# EAGLE design SmartLEDShield_ESP32_V0 (EAGLE 8.6.3)
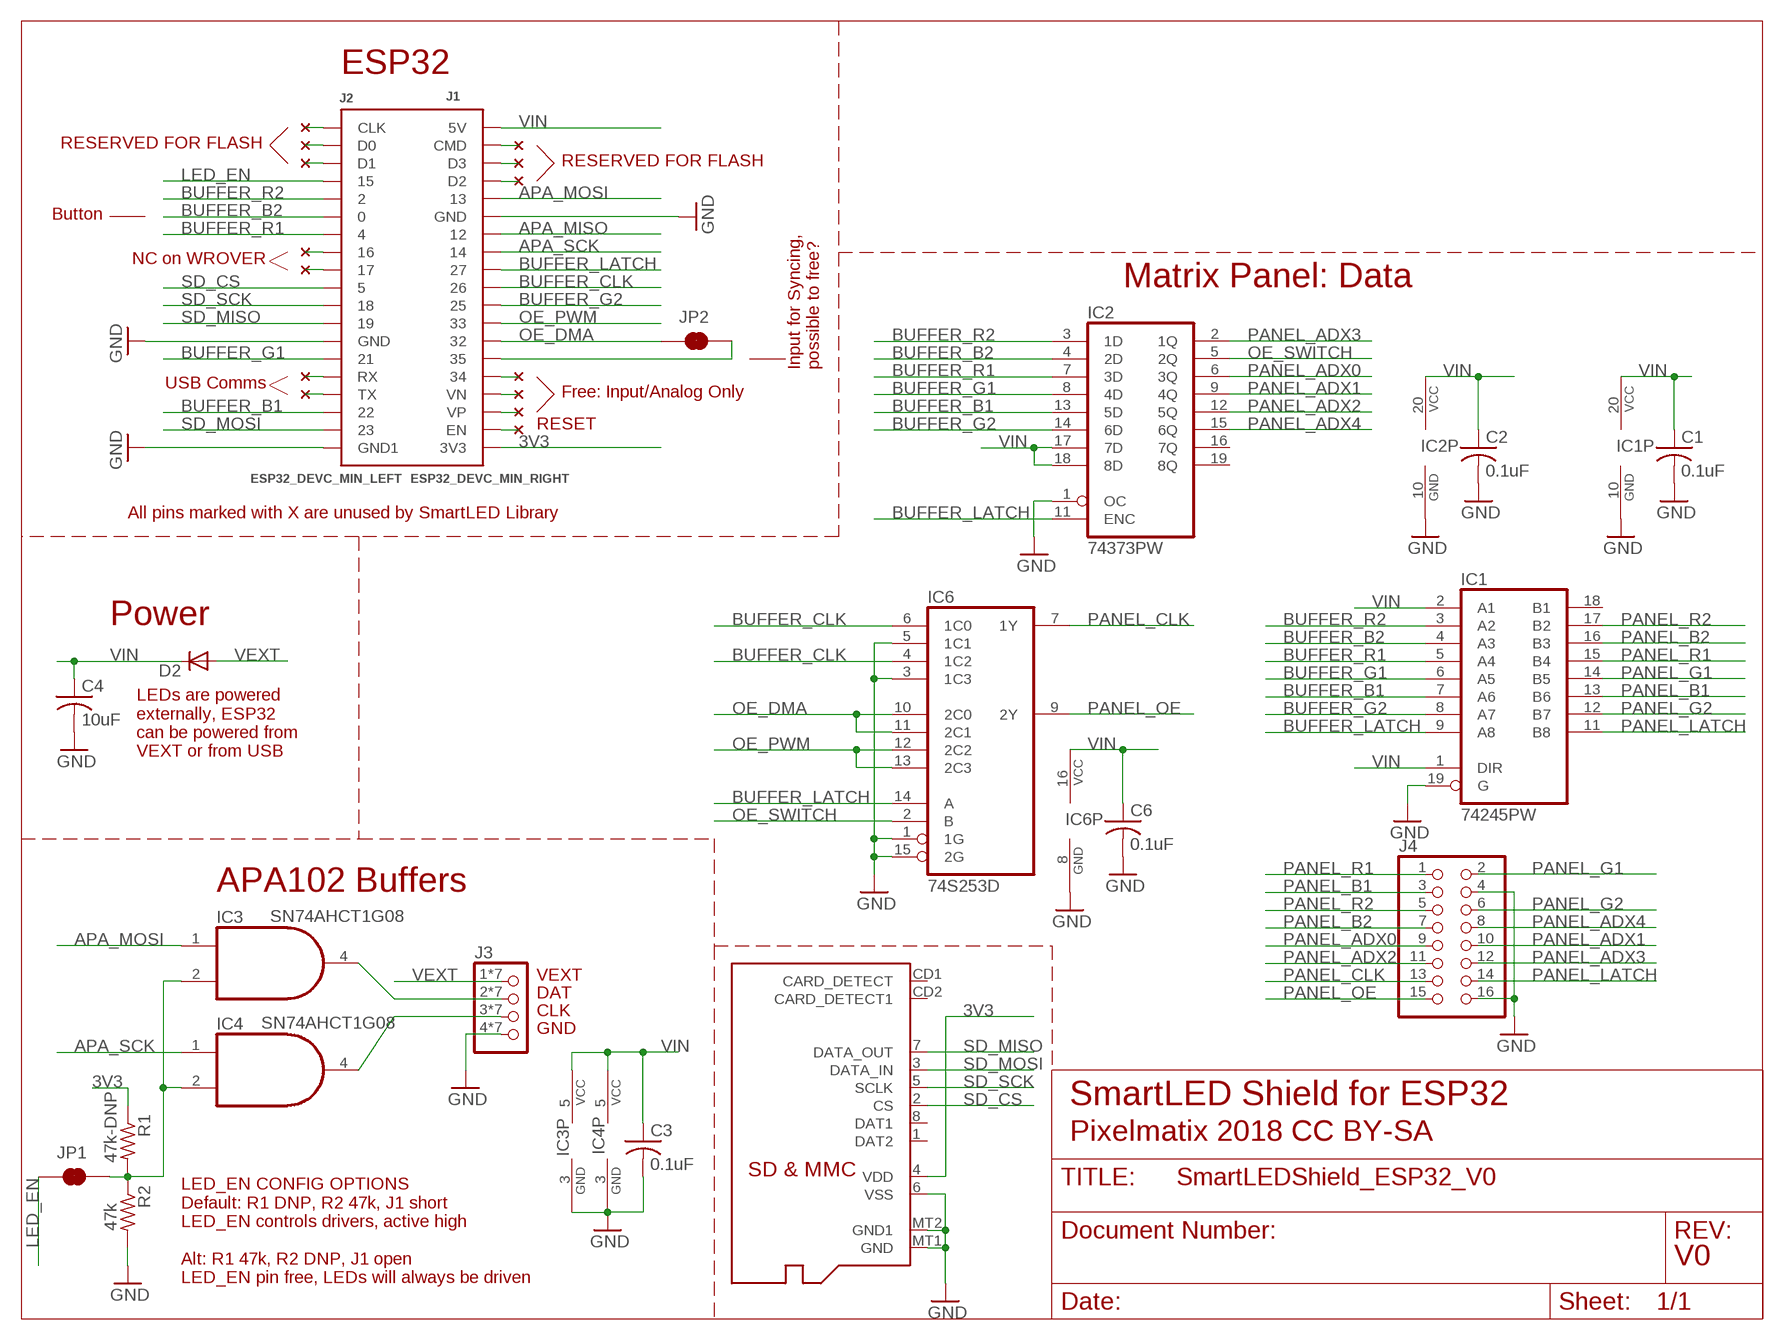
[diagram p0: schematic, sheet 1]

## Parts
C1  0.1uF  C-USC0603  [C0603]
C2  0.1uF  C-USC0603  [C0603]
C3  0.1uF  C-USC0603  [C0603]
C4  10uF  C-USC0805  [C0805]
C6  0.1uF  C-USC0603  [C0603]
D2  MBR1020VL  [SOD123-FL]
IC1  74245PW  [TSSOP-20]
IC2  74373PW  [TSSOP-20]
IC3  74AHC1G08DBV  [SOT23-5]
IC4  74AHC1G08DBV  [SOT23-5]
IC6  74S253D  [SO16]
J1  ESP32_DEVC_MIN_RIGHT  [ESP32_DEVC_DUAL_HEADER_BOT_MOUNT_RIGHT]
J2  ESP32_DEVC_MIN_LEFT  [ESP32_DEVC_DUAL_HEADER_BOT_MOUNT_LEFT]
J3  PINHD-1X04_WIREPADS_NARROW  [1X04SMDWIRES_NARROW]
J4  PINHD-2X08_SMARTMATRIX_SSMTHT  [SMARTMATRIX_SSMTHT]
J6  MICROSD  [MICROSD]
JP1  JUMPER-SMT_2_NC_TRACE_NO-SILK  [SMT-JUMPER_2_NC_TRACE_NO-SILK]
JP2  JUMPER-SMT_2_NC_TRACE_NO-SILK  [SMT-JUMPER_2_NC_TRACE_NO-SILK]
R1  47k-DNP  R-US_R0603  [R0603]
R2  47k  R-US_R0603  [R0603]
U$1  NC  (no package)
U$2  NC  (no package)
U$3  NC  (no package)
U$4  NC  (no package)
U$6  NC  (no package)
U$7  NC  (no package)
U$8  NC  (no package)
U$9  NC  (no package)
U$10  NC  (no package)
U$11  NC  (no package)
U$13  NC  (no package)
U$15  NC  (no package)
U$16  NC  (no package)
U$17  NC  (no package)

## Nets
3V3 [power]: J1.3V3A(3V3) J1.3V3B(3V3) J6.4(VDD) R1.1
APA_MISO: J1.12A J1.12B
APA_MOSI: IC3.1(I0) J1.13A_A J1.13B_B
APA_SCK: IC4.1(I0) J1.14A_A J1.14B_B
BUFFER_B1: IC1.7(A6) IC2.13(5D) J2.22A J2.22B
BUFFER_B2: IC1.4(A3) IC2.4(2D) J2.0A J2.0B
BUFFER_CLK: IC6.4(1C2) IC6.6(1C0) J1.26A J1.26B
BUFFER_G1: IC1.6(A5) IC2.8(4D) J2.21A J2.21B
BUFFER_G2: IC1.8(A7) IC2.14(6D) J1.25A J1.25B
BUFFER_LATCH: IC1.9(A8) IC2.11(ENC) IC6.14(A) J1.27A J1.27B
BUFFER_R1: IC1.5(A4) IC2.7(3D) J2.4A J2.4B
BUFFER_R2: IC1.3(A2) IC2.3(1D) J2.2A J2.2B
CLK1: IC4.4(O) J3.3 J3.3-1 J3.3-2 J3.3-3 J3.3-4 J3.3-5 J3.3-6
DAT1: IC3.4(O) J3.2 J3.2-1 J3.2-2 J3.2-3 J3.2-4 J3.2-5 J3.2-6
GND: C1.2 C2.2 C3.2 C4.2 C6.2 IC1.10(GND) IC1.19(G) IC2.1(OC) IC2.10(GND) IC3.3(GND) IC4.3(GND) IC6.1(1G) IC6.3(1C3) IC6.5(1C1) IC6.8(GND) IC6.15(2G) J1.GNDA(GND) J1.GNDB(GND) J2.GND1A(GND1) J2.GND1B(GND1) J2.GNDA(GND) J2.GNDB(GND) J3.4 J3.4-1 J3.4-2 J3.4-3 J3.4-4 J3.4-5 J3.4-6 J4.4 J4.16 J6.6(VSS) J6.MT1(GND) J6.MT2(GND1) R2.2
LED_EN: J2.15A_A J2.15B_B JP1.1
N$1: J1.35A J1.35B JP2.2
N$2: J1.CMD_A(CMD) J1.CMD_B(CMD) U$1.P$1
N$3: J1.D3_A(D3) J1.D3_B(D3) U$2.P$1
N$4: IC3.2(I1) IC4.2(I1) JP1.2 R1.2 R2.1
N$5: J1.D2A(D2) J1.D2B(D2) U$3.P$1
N$6: J2.CLKA(CLK) J2.CLKB(CLK) U$4.P$1
N$7: J2.D0A(D0) J2.D0B(D0) U$6.P$1
N$8: J2.D1A(D1) J2.D1B(D1) U$7.P$1
N$9: J1.VNA(VN) J1.VNB(VN) U$8.P$1
N$10: J1.VPA(VP) J1.VPB(VP) U$9.P$1
N$11: J1.34A J1.34B U$10.P$1
N$13: J1.ENA(EN) J1.ENB(EN) U$11.P$1
N$14: J2.TXA(TX) J2.TXB(TX) U$13.P$1
N$15: J2.RXA(RX) J2.RXB(RX) U$15.P$1
N$16: J2.17A_A J2.17B_B U$16.P$1
N$17: J2.16_B J2.16A_A U$17.P$1
OE_DMA: IC6.10(2C0) IC6.11(2C1) J1.32A J1.32B JP2.1
OE_PWM: IC6.12(2C2) IC6.13(2C3) J1.33A J1.33B
OE_SWITCH: IC2.5(2Q) IC6.2(B)
PANEL_ADX0: IC2.6(3Q) J4.9
PANEL_ADX1: IC2.9(4Q) J4.10
PANEL_ADX2: IC2.12(5Q) J4.11
PANEL_ADX3: IC2.2(1Q) J4.12
PANEL_ADX4: IC2.15(6Q) J4.8
PANEL_B1: IC1.13(B6) J4.3
PANEL_B2: IC1.16(B3) J4.7
PANEL_CLK: IC6.7(1Y) J4.13
PANEL_G1: IC1.14(B5) J4.2
PANEL_G2: IC1.12(B7) J4.6
PANEL_LATCH: IC1.11(B8) J4.14
PANEL_OE: IC6.9(2Y) J4.15
PANEL_R1: IC1.15(B4) J4.1
PANEL_R2: IC1.17(B2) J4.5
SD_CS: J2.5A J2.5B J6.2(CS)
SD_MISO: J2.19A_A J2.19B_B J6.7(DATA_OUT)
SD_MOSI: J2.23A J2.23B J6.3(DATA_IN)
SD_SCK: J2.18A_A J2.18B_B J6.5(SCLK)
VEXT: D2.A J3.1 J3.1-1 J3.1-2 J3.1-3 J3.1-4 J3.1-5 J3.1-6
VIN: C1.1 C2.1 C3.1 C4.1 C6.1 D2.C IC1.1(DIR) IC1.2(A1) IC1.20(VCC) IC2.17(7D) IC2.18(8D) IC2.20(VCC) IC3.5(VCC) IC4.5(VCC) IC6.16(VCC) J1.5V_A(5V) J1.5V_B(5V)
Unconnected: IC1.18(B1) IC2.16(7Q) IC2.19(8Q) J6.1(DAT2) J6.8(DAT1) J6.CD1(CARD_DETECT) J6.CD2(CARD_DETECT1)

## Notes on the sheet
- ESP32
- RESERVED FOR FLASH
- RESERVED FOR FLASH
- Button
- NC on WROVER
- Matrix Panel: Data
- Input for Syncing,
  possible to free?
- USB Comms
- Free: Input/Analog Only
- RESET
- All pins marked with X are unused by SmartLED Library
- Power
- LEDs are powered
  externally, ESP32
  can be powered from
  VEXT or from USB
- APA102 Buffers
- SN74AHCT1G08
- VEXT
- DAT
- CLK
- SN74AHCT1G08
- GND
- SmartLED Shield for ESP32
- Pixelmatix 2018 CC BY-SA
- V0
- LED_EN CONFIG OPTIONS
  Default: R1 DNP, R2 47k, J1 short
  LED_EN controls drivers, active high
  
  Alt: R1 47k, R2 DNP, J1 open
  LED_EN pin free, LEDs will always be driven

## Library data of the parts
C1-C4 C6 = scanlime:C-US: CAPACITOR, American symbol; PARTNO: CAP CER 0.1UF 10V 10% X7R 0805
D2 = eclibrary:MBR1020VL
IC1 = eclibrary:74*245: Octal BUS TRANSCEIVER, 3-state
IC2 = eclibrary:74*373: Octal D type transparent LATCH, edge triggered
IC3 IC4 = 74xx-little-us:74*1G08: 2-input AND gate
IC6 = 74xx-us:74*253: Dual 4-to 1 line data SELECTOR/MULTIPLEXER, 3-state
J1 = eclibrary:ESP32_DEVC_MIN_RIGHT
J2 = eclibrary:ESP32_DEVC_MIN_LEFT
J3 = eclibrary:PINHD-1X04: PIN HEADER
J4 = eclibrary:PINHD-2X08: PIN HEADER
J6 = adafruit:MICROSD: Micro-SD / Transflash card holder with SPI pinout For the 3M # 2908-05WB-MG and/or 4UCON #19656 push-push type; PARTNO: 101-00660-68-6
JP1 JP2 = SparkFun-Jumpers:JUMPER-SMT_2_NC_TRACE: Normally closed trace jumper This jumper has a trace between two pads so it's normally closed (NC). Use a razor knife to open the connection. For best results follow the IPC guidelines for cutting traces: Cutout at least 0.063 mm (0.005 in). Remove all loose material to clean up the cut area. Seal the cut with an approved epoxy. Reapply solder to reclose the connection.
R1 R2 = rcl:R-US_: RESISTOR, American symbol
U$1-U$4 U$6-U$11 U$13 U$15-U$17 = eclibrary:NC

## Net classes
0 default: width 0.254 mm
1 power: width 0.406 mm

## Board
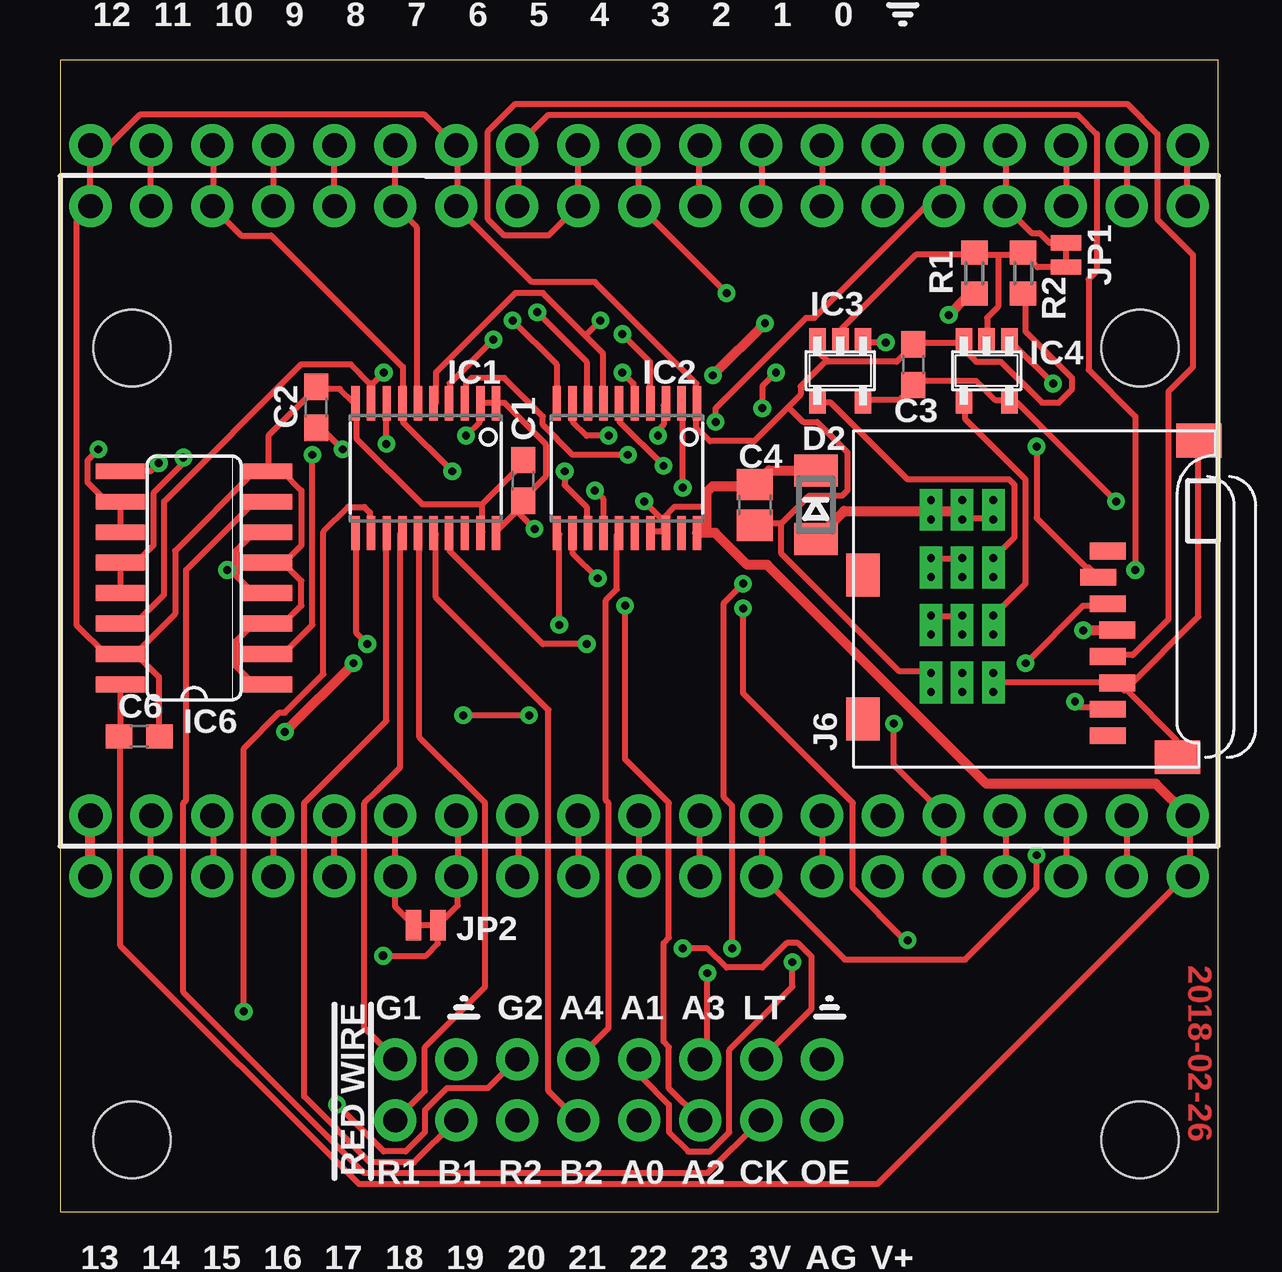
[diagram p1: board, top side]
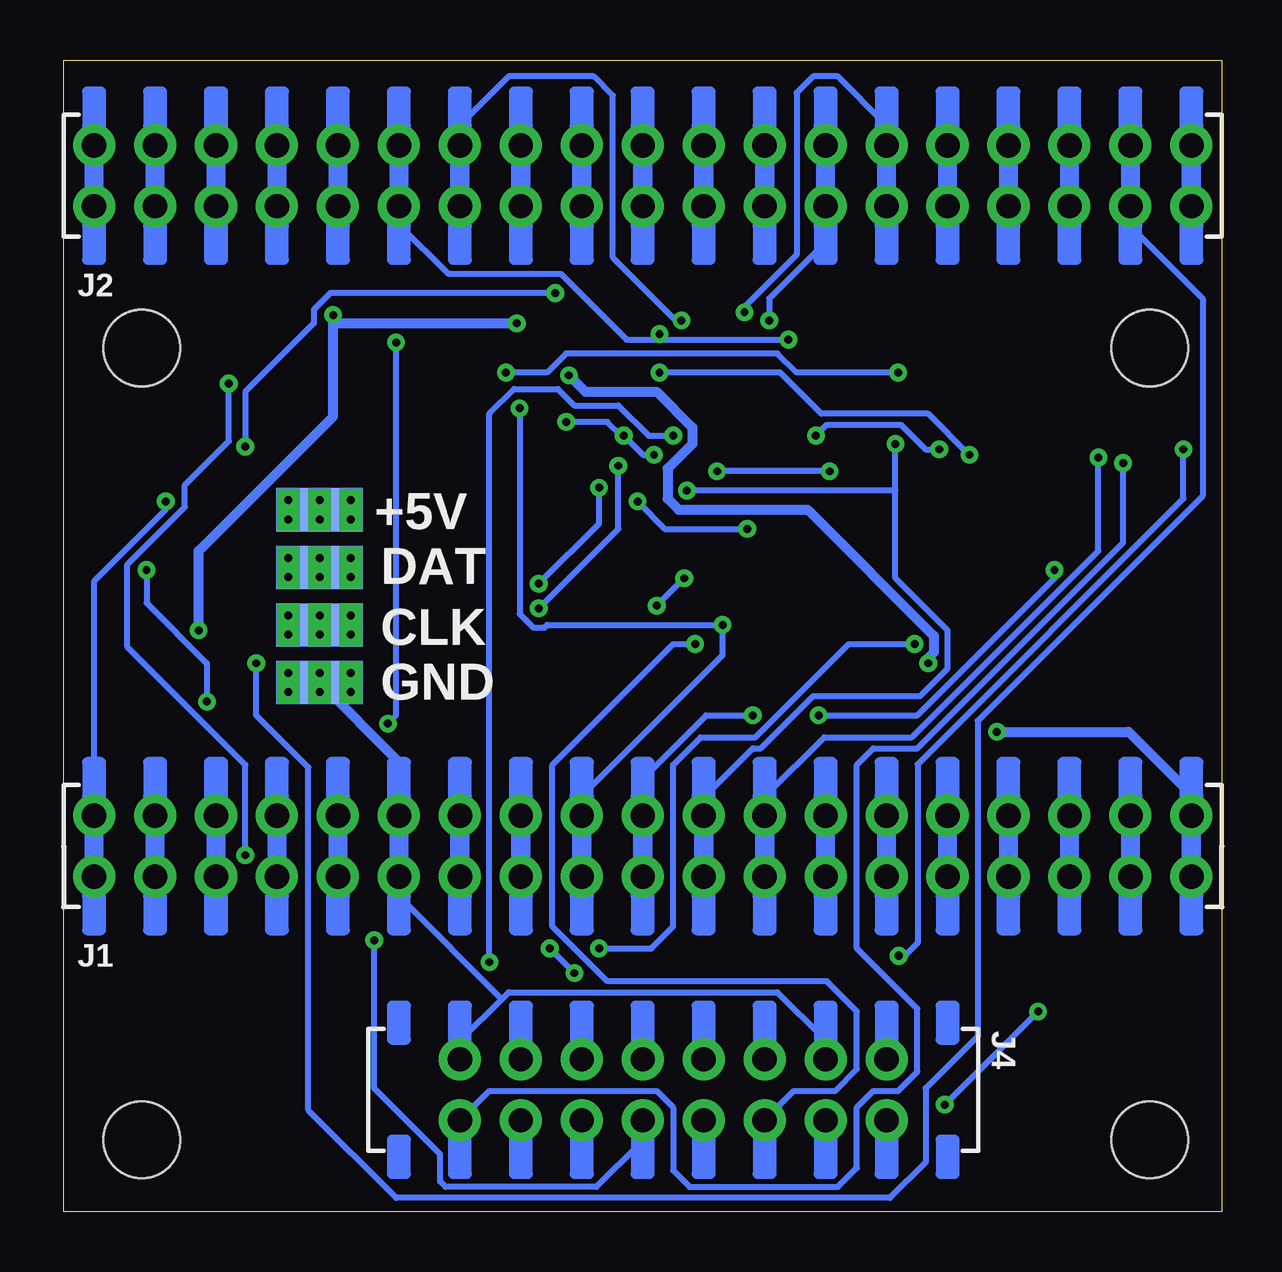
[diagram p2: board, bottom side, seen from below]

Size 48.26 x 48.01 mm. Coordinates in mm from the lower left corner, seen from the top.
Outline: 0,0 48.26,0 48.26,48.01 0,48.01 0,0
Copper layers (1*16): Top 0.0356mm / dielectric 1.5011mm / Bottom 0.0356mm
Design rules "OshParkMod-8mil-20150316": minimum track width 6mil, minimum drill 13mil, track to track 8mil, track to pad 8mil, pad to pad 8mil, via to via 8mil, smd to smd 8mil, copper to edge 15mil, drill to drill 6mil, minimum pad ring 12mil, minimum via ring 8mil, stop-mask expansion 3mil, vias tented up to drill 25mil, thermal gap 10mil

### Footprints (pad centres in the part's own frame; a part is rotated, then mirrored left to right if it is on the bottom)
C0603 = smd 1.1 x 1: 1 -0.85,0; 2 0.85,0
C0805 = smd 1.3 x 1.5: 1 -0.85,0; 2 0.85,0
SOD123-FL = smd 1.34 x 1.8: A 1.43,0; C -1.43,0
STAND-OFF-3MM = hole 3.2: 0,0
TSSOP-20 = smd 0.35 x 1.43: 1 -2.925,-2.7; 2 -2.275,-2.7; 3 -1.625,-2.7; 4 -0.975,-2.7; 5 -0.325,-2.7; 6 0.325,-2.7; 7 0.975,-2.7; 8 1.625,-2.7; 9 2.275,-2.7; 10 2.925,-2.7; 11 2.925,2.7; 12 2.275,2.7; 13 1.625,2.7; 14 0.975,2.7; 15 0.325,2.7; 16 -0.325,2.7; 17 -0.975,2.7; 18 -1.625,2.7; 19 -2.275,2.7; 20 -2.925,2.7
SOT23-5 = smd 0.69 x 0.99: 1 -0.95,-1.29; 2 0,-1.29; 3 0.95,-1.29; 4 0.95,1.3; 5 -0.95,1.3
SO16 = smd 0.66 x 2.032: 1 -4.445,-3.073; 2 -3.175,-3.073; 3 -1.905,-3.073; 4 -0.635,-3.073; 5 0.635,-3.073; 6 1.905,-3.073; 7 3.175,-3.073; 8 4.445,-3.073; 9 4.445,3.073; 10 3.175,3.073; 11 1.905,3.073; 12 0.635,3.073; 13 -0.635,3.073; 14 -1.905,3.073; 15 -3.175,3.073; 16 -4.445,3.073
ESP32_DEVC_DUAL_HEADER_BOT_MOUNT_RIGHT = drill 1.016 pad 1.753: 3V3A -1.27,-24.13; 3V3B 1.27,-24.13; 5V_A -1.27,21.59; 5V_B 1.27,21.59; 12A -1.27,6.35; 12B 1.27,6.35; 13A_A -1.27,11.43; 13B_B 1.27,11.43; 14A_A -1.27,3.81; 14B_B 1.27,3.81; 25A -1.27,-3.81; 25B 1.27,-3.81; 26A -1.27,-1.27; 26B 1.27,-1.27; 27A -1.27,1.27; 27B 1.27,1.27; 32A -1.27,-8.89; 32B 1.27,-8.89; 33A -1.27,-6.35; 33B 1.27,-6.35; 34A -1.27,-13.97; 34B 1.27,-13.97; 35A -1.27,-11.43; 35B 1.27,-11.43; CMD_A -1.27,19.05; CMD_B 1.27,19.05; D2A -1.27,13.97; D2B 1.27,13.97; D3_A -1.27,16.51; D3_B 1.27,16.51; ENA -1.27,-21.59; ENB 1.27,-21.59; GNDA -1.27,8.89; GNDB 1.27,8.89; VNA -1.27,-16.51; VNB 1.27,-16.51; VPA -1.27,-19.05; VPB 1.27,-19.05
ESP32_DEVC_DUAL_HEADER_BOT_MOUNT_LEFT = drill 1.016 pad 1.753: 0A 1.27,8.89; 0B -1.27,8.89; 2A 1.27,11.43; 2B -1.27,11.43; 4A 1.27,6.35; 4B -1.27,6.35; 5A 1.27,-1.27; 5B -1.27,-1.27; 15A_A 1.27,13.97; 15B_B -1.27,13.97; 16_B -1.27,3.81; 16A_A 1.27,3.81; 17A_A 1.27,1.27; 17B_B -1.27,1.27; 18A_A 1.27,-3.81; 18B_B -1.27,-3.81; 19A_A 1.27,-6.35; 19B_B -1.27,-6.35; 21A 1.27,-11.43; 21B -1.27,-11.43; 22A 1.27,-19.05; 22B -1.27,-19.05; 23A 1.27,-21.59; 23B -1.27,-21.59; CLKA 1.27,21.59; CLKB -1.27,21.59; D0A 1.27,19.05; D0B -1.27,19.05; D1A 1.27,16.51; D1B -1.27,16.51; GND1A 1.27,-24.13; GND1B -1.27,-24.13; GNDA 1.27,-8.89; GNDB -1.27,-8.89; RXA 1.27,-13.97; RXB -1.27,-13.97; TXA 1.27,-16.51; TXB -1.27,-16.51
1X04SMDWIRES_NARROW = smd 1.8 x 3.6: 1 -3.6,0; 2 -1.2,0; 3 1.2,0; 4 3.6,0 | drill 0.33 pad 0.508 square: 1-1 -4,1.3; 1-2 -3.2,1.3; 1-3 -4,0; 1-4 -3.2,0; 1-5 -4,-1.3; 1-6 -3.2,-1.3; 2-1 -1.6,1.3; 2-2 -0.8,1.3; 2-3 -1.6,0; 2-4 -0.8,0; 2-5 -1.6,-1.3; 2-6 -0.8,-1.3; 3-1 0.8,1.3; 3-2 1.6,1.3; 3-3 0.8,0; 3-4 1.6,0; 3-5 0.8,-1.3; 3-6 1.6,-1.3; 4-1 3.2,1.3; 4-2 4,1.3; 4-3 3.2,0; 4-4 4,0; 4-5 3.2,-1.3; 4-6 4,-1.3
SMARTMATRIX_SSMTHT = drill 1.016 pad 1.753: 1 1.27,8.89; 2 -1.27,8.89; 3 1.27,6.35; 4 -1.27,6.35; 5 1.27,3.81; 6 -1.27,3.81; 7 1.27,1.27; 8 -1.27,1.27; 9 1.27,-1.27; 10 -1.27,-1.27; 11 1.27,-3.81; 12 -1.27,-3.81; 13 1.27,-6.35; 14 -1.27,-6.35; 15 1.27,-8.89; 16 -1.27,-8.89
MICROSD = smd 0.7 x 1.5: 1 9,-10.64; 2 7.9,-10.24; 3 6.8,-10.64; 4 5.7,-11.04; 5 4.6,-10.64; 6 3.5,-11.04; 7 2.4,-10.64; 8 1.3,-10.64 | smd 1.8 x 1.4: CD1 2,-0.44; CD2 8,-0.44 | smd 1.4 x 1.9: MT1 0.4,-13.54; MT2 13.6,-14.44
SMT-JUMPER_2_NC_TRACE_NO-SILK = smd 0.635 x 1.27: 1 -0.508,0; 2 0.508,0
R0603 = smd 1 x 1.1: 1 -0.85,0; 2 0.85,0

### Placement (x,y rotation side)
C1  19.3,30.48 90 top
C2  10.67,33.53 90 top
C3  35.56,35.31 90 top
C4  28.96,29.46 270 top
C6  3.3,19.81 0 top
D2  31.5,29.46 270 top
H1  STAND-OFFSTAND-OFF-3MM  [STAND-OFF-3MM]  45,36 90 top
H3  STAND-OFFSTAND-OFF-3MM  [STAND-OFF-3MM]  3,36 90 top
H6  STAND-OFFSTAND-OFF-3MM  [STAND-OFF-3MM]  3,3 270 top
H9  STAND-OFFSTAND-OFF-3MM  [STAND-OFF-3MM]  45,3 0 top
IC1  15.24,30.99 180 top
IC2  23.62,30.99 180 top
IC3  32.51,35.05 180 top
IC4  38.61,35.05 180 top
IC6  5.59,26.42 90 top
J1  25.4,15.24 90 bottom
J2  25.4,43.18 90 bottom
J3  37.59,25.65 270 bottom
J4  22.86,5.08 270 bottom
J6  33.02,18.54 90 top
JP1  41.91,39.88 270 top
JP2  15.24,11.94 180 top
R1  38.1,39.12 90 top
R2  40.13,39.12 270 top

### Tracks (layer width: path | path; a pad name or v marks a point on that pad's centre or on a via)
3V3  (via drill 0.33)
  Top 0.406: J1.3V3B 1.26,16.46 1.26,14.06 J1.3V3A | v37.03,37.38 37.83,38.18 38.06,38.18 R1.1 | v42.63,24.23 44.01,24.23 J6.4 | v12.23,22.86 v9.37,20 | v29.38,37.03 v27.2,34.86
  Bottom 0.406: v42.63,24.23 42.63,27.55 37.03,33.15 v37.03,37.38 36.92,37.03 v29.38,37.03 | v9.37,20 3.89,20 1.37,17.49 1.37,16.57 J1.3V3B | v12.23,22.86 12.23,23.09 12,23.32 12,24 17.26,29.26 22.63,29.26 23.09,29.72 23.09,30.98 22.06,32 22.06,32.69 23.55,34.18 26.52,34.18 v27.2,34.86
APA_MISO
  Top 0.254: J1.12B 31.77,16.46 31.77,14.06 J1.12A
APA_MOSI  (via drill 0.33)
  Top 0.254: v34.4,36.23 33.49,36.23 IC3.1 | v34.75,20.34 34.75,18.63 36.8,16.57 J1.13B_B 36.8,16.46 36.8,14.06 J1.13A_A
  Bottom 0.254: v34.4,36.23 34.4,20.69 v34.75,20.34
APA_SCK  (via drill 0.33)
  Top 0.254: v41.38,34.52 39.66,36.23 IC4.1 | v40.69,14.86 40.69,13.49 37.72,10.52 32.69,10.52 29.26,13.95 J1.14A_A 29.26,14.06 29.26,16.46 J1.14B_B
  Bottom 0.254: v41.38,34.52 41.38,32.12 43.2,30.29 43.2,29.38 45.61,26.98 45.61,23.55 40.69,18.63 v40.69,14.86
BUFFER_B1  (via drill 0.33)
  Top 0.254: v21.03,30.86 21.03,30.29 21.95,29.38 21.95,28.35 IC2.13 | v16.34,30.86 14.29,32.92 14.29,33.6 IC1.7 14.29,33.72 14.29,35.2 8.8,40.69 7.54,40.69 6.4,41.83 J2.22B 6.4,41.95 6.4,44.35 J2.22A
  Bottom 0.254: v16.34,30.86 v21.03,30.86
BUFFER_B2  (via drill 0.33)
  Top 0.254: v18.06,36.35 16.23,34.52 16.23,33.72 IC1.4 | v23.43,36.58 24.57,35.43 24.57,33.72 IC2.4 | J2.0B J2.0A
  Bottom 0.254: 23.43,36.35 24.8,36.35 27.55,39.09 32.23,39.09 34.29,41.15 J2.0B | 23.43,36.35 v18.06,36.35 | v23.43,36.58 23.43,36.35
BUFFER_CLK  (via drill 0.33)
  Top 0.254: 7.32,26.75 7.32,27.55 8,28.23 8.57,28.23 IC6.6 | 7.32,26.75 7.32,26.52 8,25.83 8.57,25.83 IC6.4 | v6.97,26.75 7.32,26.75 | v19.55,20.69 v16.8,20.69 | J1.26A 24.12,14.06 24.12,16.46 J1.26B
  Bottom 0.254: v6.97,26.75 6.97,26.4 12.69,20.69 v16.8,20.69 | v19.55,20.69 21.49,20.69 24.12,18.06 24.12,16.57 J1.26B
BUFFER_G1  (via drill 0.33)
  Top 0.254: IC1.6 14.86,33.72 14.86,41.03 14.06,41.83 J2.21B 13.95,41.95 13.95,44.35 J2.21A | v19.89,37.49 21.95,35.43 21.95,33.72 IC2.8
  Bottom 0.254: v19.89,37.49 19.89,37.72 17.72,39.89 17.72,46.63 17.03,47.32 16,47.32 14.06,45.38 14.06,44.46 J2.21A
BUFFER_G2  (via drill 0.33)
  Top 0.254: v13.6,32 13.6,33.6 IC1.8 | v22.29,30.06 22.63,29.72 22.63,28.35 IC2.14 | J1.25A 21.6,14.06 21.6,16.46 J1.25B
  Bottom 0.254: 13.6,30.06 13.6,26.4 11.43,24.23 11.43,22.63 12.57,21.49 17.03,21.49 19.2,19.32 19.55,19.32 21.49,17.37 21.49,16.57 J1.25B | 13.6,30.06 v13.6,32 | 13.6,30.06 v22.29,30.06
BUFFER_LATCH  (via drill 0.33)
  Top 0.254: v20.8,24.46 20.8,28.23 IC2.11 | J1.27A 26.63,14.06 26.63,16.46 J1.27B | 12.92,34.52 12.92,33.72 IC1.9 | 12.92,34.52 12.12,35.32 10.06,35.32 4.34,29.6 4.34,25.72 3.2,24.57 2.52,24.57 IC6.14 | v29.26,33.49 29.26,34.4 v29.83,34.98 | v13.49,34.98 13.03,34.52 12.92,34.52
  Bottom 0.254: J1.27B 26.63,16.57 26.63,17.37 20.8,23.2 v20.8,24.46 28.12,24.46 28.23,24.35 28.69,24.35 29.26,24.92 v29.26,33.49 | v29.83,34.98 28.12,34.98 27.32,35.78 18.52,35.78 17.72,34.98 v13.49,34.98
BUFFER_R1  (via drill 0.33)
  Top 0.254: J2.4A 31.77,44.35 31.77,41.95 J2.4B | 21.89,36.52 22.63,35.78 22.63,33.72 IC2.7 | 21.89,36.52 20.12,38.29 18.97,38.29 15.66,34.98 15.66,33.72 IC1.5 | 21.89,36.52 v22.52,37.15
  Bottom 0.254: v22.52,37.15 22.75,37.15 25.38,39.78 25.38,46.52 26.18,47.32 29.72,47.32 31.66,45.38 31.66,44.46 J2.4A
BUFFER_R2  (via drill 0.33)
  Top 0.254: J2.2A 36.8,44.35 36.8,41.95 J2.2B 36.69,41.95 36.12,41.95 31.43,37.26 31.09,37.26 27.32,33.49 v27.32,32.92 | v23.66,31.55 21.37,31.55 20.12,32.8 20.12,33.15 18.52,34.75 17.14,34.75 16.92,34.52 16.92,33.72 IC1.3 | v24.92,32.35 24.92,32.58 25.15,32.8 25.15,33.6 IC2.3
  Bottom 0.254: v23.66,31.55 24.12,31.55 v24.92,32.35 25.03,32.35 25.6,32.92 v27.32,32.92
CLK1
  Top 0.254: J3.3-2 36.35,24.12 36.35,24.8 J3.3-1 36.46,24.8 37.49,24.8 J3.3-3 | IC4.4 37.72,33.72 37.72,33.03 40.23,30.52 40.23,26.18 38.98,24.92 J3.3-5 38.98,24.8 38.98,24.12 J3.3-6
  Bottom 0.254: J3.3-3 37.6,24.8 37.6,24.57 J3.3 37.6,24.35 37.6,24.12 J3.3-4 37.72,24.12 38.86,24.12 J3.3-6
DAT1
  Top 0.254: J3.2-2 36.35,26.52 36.35,27.2 J3.2-1 36.46,27.2 37.49,27.2 J3.2-3 | IC3.4 31.66,33.72 32.12,33.72 35.32,30.52 39.55,30.52 39.78,30.29 39.78,28.12 38.98,27.32 J3.2-5 38.98,27.2 38.98,26.52 J3.2-6
  Bottom 0.254: J3.2-3 37.6,27.2 37.6,26.98 J3.2 37.6,26.75 37.6,26.52 J3.2-4 37.72,26.52 38.86,26.52 J3.2-6
GND  (via drill 0.33)
  Top 0.254: IC6.1 8.57,22.06 8,22.06 7.32,22.75 7.32,23.77 8,24.46 8.57,24.46 IC6.3 8.69,24.57 9.37,24.57 10.06,25.26 10.06,26.29 9.37,26.98 8.69,26.98 IC6.5 9.37,27.09 10.06,27.77 10.06,30.06 9.26,30.86 IC6.8 | C6.2 4.12,19.89 4.12,22.29 3.2,23.2 2.52,23.2 IC6.15 | 17.6,29.49 19.2,31.09 19.2,31.32 C1.2 | 17.6,29.49 17.6,28.35 IC1.19 | IC6.8 8.69,30.86 8.69,32.35 10.63,34.29 C2.2 10.74,34.29 11.66,34.29 12.23,33.72 IC1.10 12.34,33.6 12.34,32.23 15.09,29.49 17.6,29.49 | IC6.8 8.12,30.86 4.8,27.55 4.8,24.92 3.2,23.32 IC6.15 | v18.86,37.15 20.69,35.32 20.69,33.72 IC2.10 | IC6.15 2.4,23.2 1.94,23.2 0.69,24.46 0.69,41.26 1.26,41.83 J2.GND1B 1.26,41.95 1.26,44.35 J2.GND1A 1.37,44.46 2.06,44.46 3.31,45.72 15.2,45.72 16.46,44.46 J2.GNDA 16.57,44.35 16.57,41.95 J2.GNDB 16.57,41.83 19.66,38.75 22.29,38.75 26.52,34.52 26.52,33.72 IC2.1 26.52,33.6 26.52,32.69 27.09,32.12 28.92,32.12 30.35,33.55 | 31.95,35.49 32,35.43 34.86,35.43 35.55,36.12 C3.2 35.66,36.23 37.6,36.23 IC4.3 37.49,36.12 38.18,35.43 39.2,35.43 40.92,33.72 41.6,33.72 42.18,34.29 42.18,34.75 40.23,36.69 40.23,38.18 R2.2 | 31.95,35.49 31.66,35.78 31.66,36.23 IC3.3 | 30.35,33.55 30.86,34.06 30.86,34.4 31.95,35.49 | 30.06,28.69 29.03,28.69 C4.2 | 30.06,28.69 31.2,29.83 32.58,29.83 32.8,30.06 32.8,31.66 31.55,32.92 30.98,32.92 30.35,33.55 | J3.4-5 38.98,22.4 38.98,21.72 J3.4-6 39.09,22.06 44.01,22.06 J6.6 | J3.4-2 36.35,21.72 36.35,22.4 J3.4-1 36.23,22.52 34.98,22.52 30.06,27.43 30.06,28.69 | J6.6 44.12,21.95 44.35,21.72 44.46,21.72 46.52,19.66 46.52,18.97 J6.MT1 | J6.MT2 47.43,32.12 47.43,24.8 44.46,21.83 J6.6
  Bottom 0.254: v18.86,37.15 18.86,38.06 16.57,40.35 16.57,41.83 J2.GNDB | 30,8.86 31.66,7.2 31.66,6.4 J4.16 | 30,8.86 29.72,9.14 18.52,9.14 16.57,7.2 16.57,6.4 J4.4 | J3.4-2 36.35,21.6 36.69,21.26 J3.4 | J3.4-4 37.49,21.72 J3.4 | J3.4-3 37.6,22.4 37.6,22.17 J3.4 | J3.4-5 38.86,22.4 37.72,22.4 J3.4 | J1.GNDB J1.GNDA 34.18,13.95 34.18,13.03 30,8.86
  Bottom 0.406: J1.GNDB 34.29,18.75 J3.4
LED_EN
  Top 0.254: J2.15A_A 39.43,44.35 39.43,41.95 J2.15B_B 40.48,40.8 40.82,40.8 41.23,40.39 41.45,40.39 JP1.1
N$1
  Top 0.254: JP2.2 13.97,12.7 J1.35A J1.35B
N$2
  Top 0.254: J1.CMD_B 44.46,16.46 44.46,14.06 J1.CMD_A
N$3
  Top 0.254: J1.D3_B 41.95,16.46 41.95,14.06 J1.D3_A
N$4
  Top 0.254: 39.09,39.88 39.62,39.88 39.71,39.97 R2.1 40.73,39.37 JP1.2 | 39.09,39.88 38.19,39.88 R1.2 38.06,39.89 35.66,39.89 32.58,36.8 32.58,36.35 IC3.2 | 39.09,39.88 39.09,37.72 38.63,37.26 38.63,36.35 IC4.2
N$5
  Top 0.254: J1.D2B 39.43,16.46 39.43,14.06 J1.D2A
N$6
  Top 0.254: J2.CLKA 46.98,44.35 46.98,41.95 J2.CLKB
N$7
  Top 0.254: J2.D0A 44.46,44.35 44.46,41.95 J2.D0B
N$8
  Top 0.254: J2.D1A 41.95,44.35 41.95,41.95 J2.D1B
N$9
  Top 0.254: J1.VNB 8.91,16.46 8.91,14.06 J1.VNA
N$10
  Top 0.254: J1.VPB 6.4,16.46 6.4,14.06 J1.VPA
N$11
  Top 0.254: J1.34A J1.34B
N$13
  Top 0.254: J1.ENB 3.77,16.46 3.77,14.06 J1.ENA
N$14
  Top 0.254: J2.TXA 8.91,44.35 8.91,41.95 J2.TXB
N$15
  Top 0.254: J2.RXB J2.RXA
N$16
  Top 0.254: J2.17A_A 26.63,44.35 26.63,41.95 J2.17B_B
N$17
  Top 0.254: J2.16A_A 29.26,44.35 29.26,41.95 J2.16_B
OE_DMA  (via drill 0.33, 0.35)
  Top 0.254: 16.46,13.95 J1.32A 16.57,14.06 | IC6.11 IC6.10 2.4,29.6 1.94,29.6 1.14,30.4 1.14,31.32 v1.6,31.77 | 16.46,16.57 J1.32B 16.57,16.46 16.57,14.06 | JP2.1 16.07,12.26 | 16.07,12.26 16.57,12.76 16.57,14.06 | v13.46,10.67 15.24,10.67 15.75,11.18 15.75,12.39 15.94,12.39 16.07,12.26
  Bottom 0.254: v1.6,31.77 1.6,29.72 12.68,18.64 12.68,11.2 13.21,10.67 v13.46,10.67
OE_PWM  (via drill 0.33)
  Top 0.254: IC6.13 IC6.12 2.63,27.09 3.2,27.09 3.89,27.77 3.89,29.95 5.14,31.2 v5.14,31.43 | J1.33A 19.09,14.06 19.09,16.46 J1.33B
  Bottom 0.254: v5.14,31.43 5.14,27.55 12.92,19.77 16.57,19.77 18.97,17.37 18.97,16.57 J1.33B
OE_SWITCH  (via drill 0.33)
  Top 0.254: v23.43,34.98 23.89,34.52 23.89,33.72 IC2.5 | v10.52,31.55 10.52,24.46 9.37,23.32 8.69,23.32 IC6.2
  Bottom 0.254: v23.43,34.98 18.4,34.98 16.69,33.26 12.23,33.26 v10.52,31.55
PANEL_ADX0  (via drill 0.33)
  Top 0.254: v25.15,31.09 23.32,32.92 23.32,33.6 IC2.6 | v28.46,25.15 28.46,21.6 33.03,17.03 33.03,13.49 35.2,11.32 v35.32,11.32
  Bottom 0.254: v25.15,31.09 25.15,28.46 v28.46,25.15 | v35.32,11.32 35.32,5.14 32.58,2.4 32.58,1.26 32.35,1.03 26.06,1.03 24.23,2.86 24.23,3.77 J4.9
PANEL_ADX1  (via drill 0.33)
  Top 0.254: v22.86,32.35 21.95,32.35 21.37,32.92 21.37,33.6 IC2.9 | v30.52,10.4 30.52,9.37 27.89,6.74 27.89,3.31 27.09,2.52 26.18,2.52 25.38,3.31 25.38,4.46 24.23,5.6 24.23,6.29 J4.10
  Bottom 0.254: v22.86,32.35 23.89,32.35 25.15,33.6 26.98,33.6 27.66,34.29 29.49,34.29 30.52,33.26 v30.52,10.4
PANEL_ADX2  (via drill 0.33)
  Top 0.254: v22.4,26.4 21.37,27.43 21.37,28.23 IC2.12 | v23.55,25.26 23.55,18.86 25.38,17.03 25.38,11.43 25.15,11.2 25.15,7.09 25.38,6.86 25.38,5.14 26.63,3.89 J4.11
  Bottom 0.254: v23.55,25.26 v22.4,26.4
PANEL_ADX3  (via drill 0.33)
  Top 0.254: v25.95,30.18 25.95,33.6 IC2.2 | v28.46,26.18 27.66,25.38 27.66,17.26 28,16.92 v28,10.97 | v26.98,9.94 26.98,6.63 26.75,6.4 J4.12
  Bottom 0.254: v25.95,30.18 25.95,28.69 v28.46,26.18 | v26.98,9.94 v28,10.97
PANEL_ADX4
  Top 0.254: IC2.15 23.2,28.23 23.2,25.95 22.75,25.49 22.75,17.14 22.86,17.03 22.86,7.66 21.6,6.4 J4.8
PANEL_B1
  Top 0.254: IC1.13 13.6,28.23 13.6,20.46 10.17,17.03 10.17,4.8 12.92,2.06 14.74,2.06 16.46,3.77 J4.3
PANEL_B2
  Top 0.254: IC1.16 15.66,28.23 15.66,25.6 20.34,20.92 20.34,5.03 21.49,3.89 J4.7
PANEL_CLK
  Top 0.254: IC6.7 8.57,29.49 8,29.49 5.26,26.75 5.26,17.14 5.14,17.03 5.14,9.14 12.69,1.6 26.98,1.6 29.15,3.77 J4.13
PANEL_G1
  Top 0.254: IC1.14 14.17,28.23 14.17,18.52 13.32,17.67 13.2,17.54 12.69,17.03 12.69,7.66 13.95,6.4 J4.2
PANEL_G2  (via drill 0.33)
  Top 0.254: v7.66,8.34 7.66,19.32 9.14,20.8 9.37,20.8 10.97,22.4 10.97,28.35 12,29.38 12.69,29.38 12.92,29.15 12.92,28.35 IC1.12 | v11.54,4.46 13.49,2.52 14.4,2.52 15.2,3.31 15.2,4.23 16.12,5.14 17.83,5.14 18.97,6.29 J4.6
  Bottom 0.254: v11.54,4.46 v7.66,8.34
PANEL_LATCH  (via drill 0.33)
  Top 0.254: v12.8,23.66 12.34,24.12 12.34,28.23 IC1.11 | v25.95,10.97 26.98,10.97 27.77,10.17 29.26,10.17 30.29,11.2 30.75,11.2 31.32,10.63 31.32,8.46 J4.14
  Bottom 0.254: v12.8,23.66 15.54,23.66 19.43,19.77 21.72,19.77 22.86,18.63 22.86,11.89 23.77,10.97 v25.95,10.97
PANEL_OE  (via drill 0.33)
  Top 0.254: IC6.9 3.77,30.86 v4.12,31.2
  Bottom 0.254: v4.12,31.2 4.12,27.89 12.69,19.32 14.52,19.32 15.2,18.63 15.2,10.97 12.69,8.46 12.69,5.83 13.49,5.03 14.52,5.03 15.2,4.34 15.2,1.83 16,1.03 22.17,1.03 22.86,1.71 22.86,4.34 23.55,5.03 30.52,5.03 31.66,3.89 J4.15
PANEL_R1
  Top 0.254: IC1.15 14.97,28.23 14.97,19.77 17.72,17.03 17.72,9.37 15.2,6.86 15.2,5.03 14.06,3.89 J4.1
PANEL_R2  (via drill 0.33)
  Top 0.254: v21.95,23.66 20.12,23.66 16.23,27.55 16.23,28.23 IC1.17
  Bottom 0.254: v21.95,23.66 22.86,23.66 27.89,18.63 27.89,11.89 25.6,9.6 16.46,9.6 15.2,8.34 15.2,5.94 16.12,5.03 17.83,5.03 J4.5
SD_CS  (via drill 0.33)
  Top 0.254: v40.69,31.89 40.69,28.92 42.75,26.86 42.86,26.86 43.2,26.52 J6.2 | v27.77,38.29 24.23,41.83 J2.5B 24.12,41.95 24.12,44.35 J2.5A
  Bottom 0.254: v40.69,31.89 40.69,34.18 37.83,37.03 37.83,37.6 37.15,38.29 v27.77,38.29
SD_MISO  (via drill 0.33)
  Top 0.254: v42.29,21.26 42.52,21.03 43.55,21.03 J6.7 | v44.81,26.75 44.81,33.15 42.86,35.09 42.86,38.86 43.2,39.2 43.2,44.92 42.41,45.72 20.34,45.72 19.09,44.46 J2.19A_A 19.09,44.35 19.09,41.95 J2.19B_B
  Bottom 0.254: v42.29,21.26 42.29,22.86 44.81,25.38 v44.81,26.75
SD_MOSI  (via drill 0.33)
  Top 0.254: v40.23,22.86 42.63,25.26 43.55,25.26 J6.3 | J2.23A 3.77,44.35 3.77,41.95 J2.23B
  Bottom 0.254: v40.23,22.86 40.23,20.69 38.06,18.52 38.06,4.23 34.4,0.57 13.83,0.57 12.34,2.06 12.34,5.14 10.17,7.32 10.17,20.46 0.8,29.83 0.8,38.06 3.77,41.03 3.77,41.83 J2.23B
SD_SCK
  Top 0.254: J6.5 43.66,23.2 44.69,23.2 46.18,24.69 46.18,34.18 47.21,35.2 47.21,39.89 45.72,41.38 45.72,44.92 44.46,46.18 18.97,46.18 17.83,45.03 17.83,41.38 18.52,40.69 20.34,40.69 21.49,41.83 J2.18B_B 21.6,41.95 21.6,44.35 J2.18A_A
VEXT
  Top 0.254: J3.1-5 38.98,29.6 38.98,28.92 J3.1-6 38.86,28.92 37.72,28.92 J3.1-4 | J3.1-2 36.35,28.92 36.35,29.21 36.35,29.6 J3.1-1
  Top 0.406: D2.A 32.67,29.21 36.35,29.21 37.24,29.21 J3.1-4
  Bottom 0.254: J3.1-4 37.6,28.92 37.6,29.15 J3.1 37.6,29.38 37.6,29.6 J3.1-3
VIN  (via drill 0.33)
  Top 0.254: C1.1 19.2,29.6 19.2,29.38 18.17,28.35 IC1.20 | v11.77,31.77 10.97,32.58 10.74,32.58 C2.1 | v16.92,32.35 17.49,32.92 17.49,33.6 IC1.2 17.6,33.72 18.06,33.72 IC1.1 18.29,33.72 18.52,33.72 20.23,32 20.23,30.63 19.32,29.72 C1.1 | IC3.5 33.49,33.83 34.98,33.83 35.55,34.4 C3.1 35.66,34.52 35.78,34.63 38.18,34.63 38.98,33.83 39.55,33.83 IC4.5 39.66,33.72 39.89,33.72 v44.01,29.6 | IC6.16 2.52,19.89 C6.1 2.52,19.77 2.52,11.09 12.46,1.14 34.06,1.14 46.86,13.95 J1.5V_A 47.09,14.06 47.09,16.34 J1.5V_B | IC2.17 24.69,28.35 25.15,28.35 IC2.18 25.15,28.46 25.15,28.92 | 25.15,28.92 25.6,29.38 26.92,29.38 | v19.77,28.46 19.09,29.15 C1.1 | v24.35,29.6 25.03,28.92 25.15,28.92
  Top 0.406: D2.C 29.54,30.89 C4.1 28.87,30.23 27.18,30.23 26.92,29.97 26.92,29.38 26.92,28.29 | J1.5V_B 45.66,17.84 38.6,17.84 29.47,26.96 28.64,26.96 27.31,28.29 26.92,28.29 | 26.92,28.29 IC2.20
  Bottom 0.254: v11.77,31.77 12.34,31.77 13.37,32.8 16.46,32.8 v16.92,32.35 | v44.01,29.6 44.01,29.26 46.98,26.29 46.98,16.57 J1.5V_B | v19.77,28.46 23.2,28.46 v24.35,29.6

### Text on the board
Top: 2018-02-26
tPlace: 12 | 11 | 10 | 9 | 8 | 7 | 6 | 5 | 4 | 3 | 2 | 1 | 0 | pixl.mx/ / smkit12 | SmartLED / Shield / Teensy | V4 | for | G1 | G2 | G2 | A4 | A1 | A3 | LT | RED WIRE | R1 | B1 | R2 | B2 | A0 | A2 | CK | OE | 13 | 14 | 15 | 16 | 17 | 18 | 19 | 20 | 21 | 22 | 23 | 3V | AG | V+
bPlace: +5V | DAT | CLK | GND
tNames: IC3 | IC4
Document: SmartLED Shield for Teensy | Rev V4 | Pixelmatix 2017 CC BY-SA